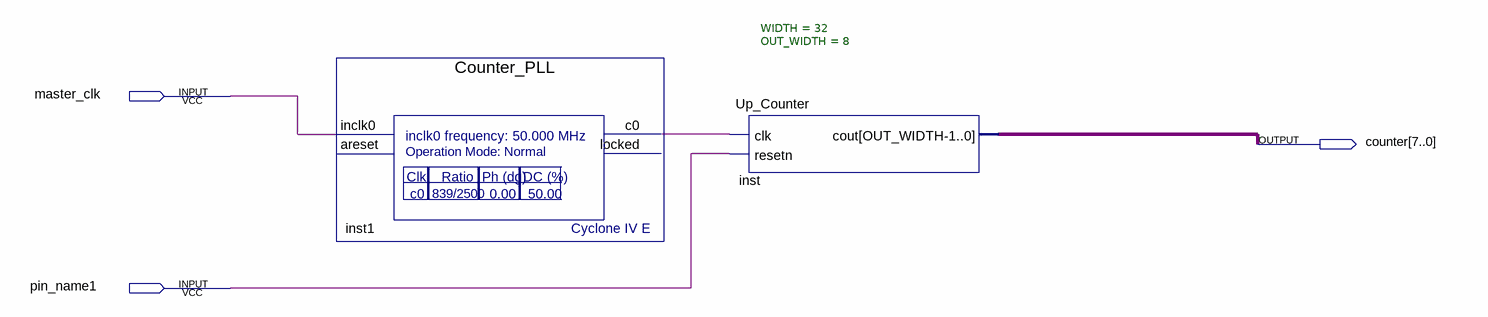
[diagram p0: schematic sheet]
// Quartus schematic Counter.bdf as structural Verilog: 2 symbols, 3 pins
module Counter (
  input  master_clk,
  input  pin_name1,
  output [7:0] counter
);

  wire inst1_c0;

  Counter_PLL inst1 (.inclk0(master_clk), .c0(inst1_c0));  // open: areset, locked
  Up_Counter #(.WIDTH(32), .OUT_WIDTH(8)) inst (.clk(inst1_c0), .resetn(pin_name1), .cout(counter));
endmodule
